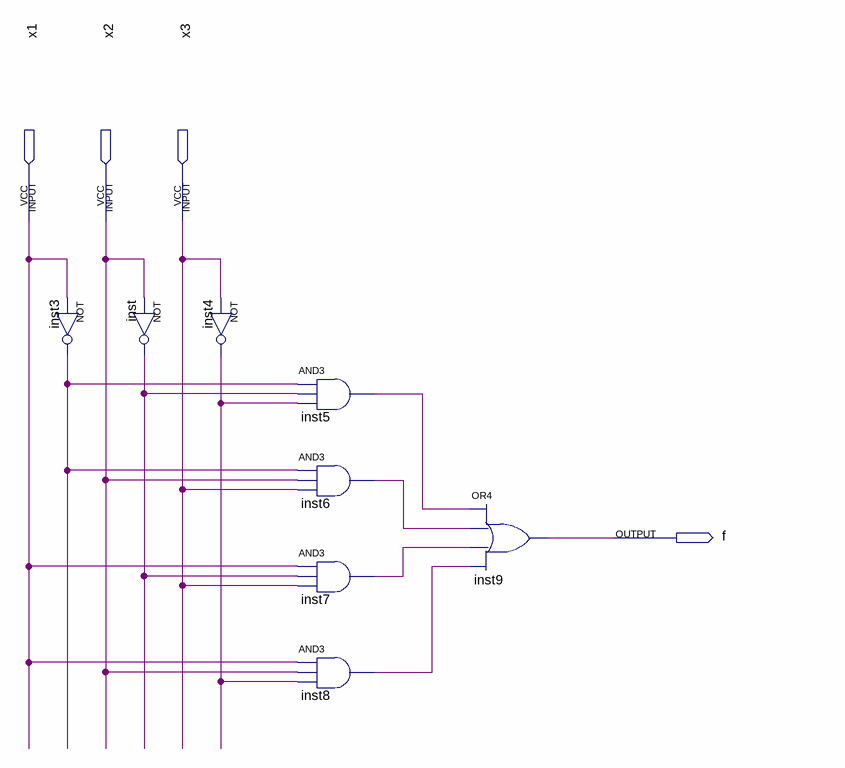
[diagram p0: schematic sheet]
// Quartus schematic X0102.bdf as structural Verilog: 8 symbols, 4 pins
module X0102 (
  input  x1,
  input  x2,
  input  x3,
  output f
);

  wire inst3_out, inst4_out, inst5_out, inst6_out, inst7_out, inst8_out, inst_out;

  not inst3 (inst3_out, x1);
  not inst (inst_out, x2);
  not inst4 (inst4_out, x3);
  and inst5 (inst5_out, inst3_out, inst_out, inst4_out);
  and inst6 (inst6_out, inst3_out, x2, x3);
  and inst7 (inst7_out, x1, inst_out, x3);
  and inst8 (inst8_out, x1, x2, inst4_out);
  or inst9 (f, inst5_out, inst6_out, inst7_out, inst8_out);
endmodule
